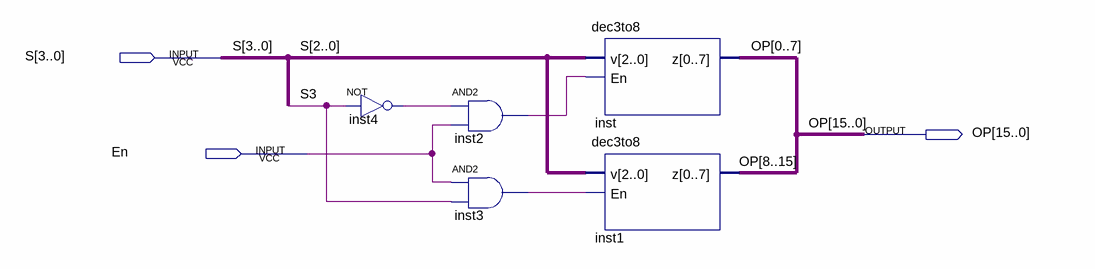
[diagram p0: schematic sheet]
// Quartus schematic dec4to16.bdf as structural Verilog: 5 symbols, 3 pins
module dec4to16 (
  input  [3:0] S,
  input  En,
  output [15:0] OP
);

  wire inst2_out, inst3_out, inst4_out;

  not inst4 (inst4_out, S[3]);
  and inst2 (inst2_out, inst4_out, En);
  and inst3 (inst3_out, En, S[3]);
  dec3to8 inst (.v(S[2:0]), .En(inst2_out), .z({OP[0], OP[1], OP[2], OP[3], OP[4], OP[5], OP[6], OP[7]}));
  dec3to8 inst1 (.v(S[2:0]), .En(inst3_out), .z({OP[8], OP[9], OP[10], OP[11], OP[12], OP[13], OP[14], OP[15]}));
endmodule
